# EAGLE design msp430_wbreakout (EAGLE 7.5.0)
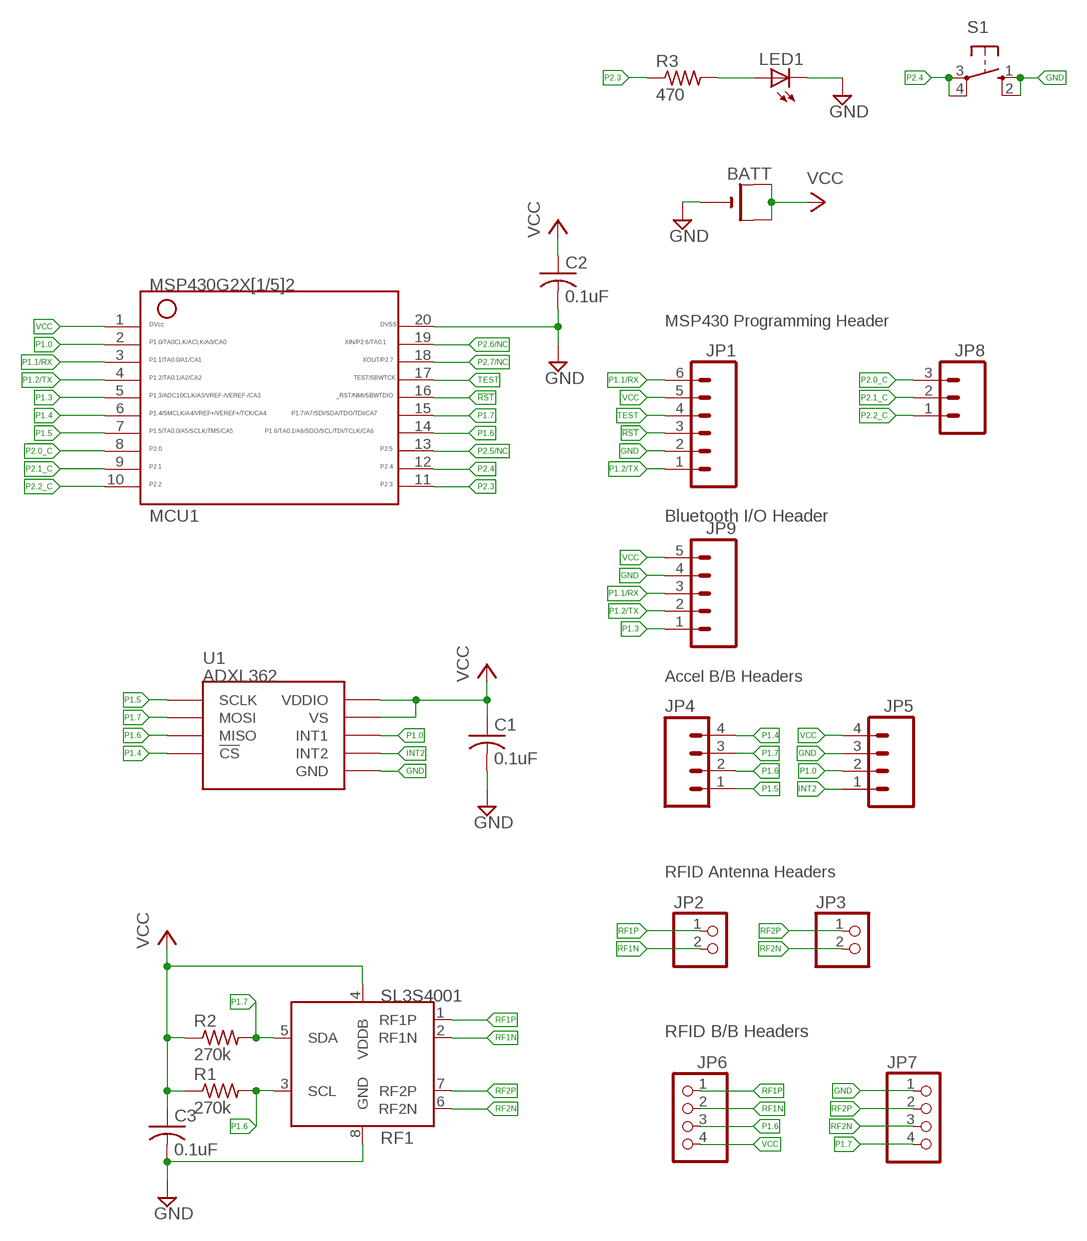
[diagram p0: schematic, sheet 1]

## Parts
BATT  CR2032SMT  [CR2032-SMD]
C1  0.1uF  C-USC0805  [C0805]
C2  0.1uF  C-USC0805K  [C0805K]
C3  0.1uF  C-USC0805  [C0805]
JP1  M06LOCK  [1X06_LOCK]
JP2  PINHD-1X2  [1X02]
JP3  PINHD-1X2  [1X02]
JP4  M04LOCK  [1X04_LOCK]
JP5  M04LOCK  [1X04_LOCK]
JP6  PINHD-1X4  [1X04]
JP7  PINHD-1X4  [1X04]
JP8  M03LOCK  [1X03_LOCK]
JP9  M05LOCK  [1X05_LOCK]
LED1  LEDCHIP-LED0805  [CHIP-LED0805]
MCU1  G2X[1/5]2---PW20  [PW20]
R1  270k  R-US_R0805  [R0805]
R2  270k  R-US_R0805  [R0805]
R3  470  R-US_R0805  [R0805]
RF1  SL3S4001  [SOT902-1/2/3]
S1  10-XX  [B3F-10XX]
U1  ADXL362  [ADXL362]

## Nets
!RST: JP1.3 MCU1.16
DVSS: C2.2 MCU1.20 ; supply symbol labelled GND
GND: BATT.- C1.2 C3.2 JP1.2 JP5.3 JP7.1 JP9.4 LED1.C RF1.8(GND) S1.1(S) S1.2(S1) U1.P$12(GND) U1.P$13(GND) U1.P$16(GND)
INT2: JP5.1 U1.P$9(INT2)
N$1: LED1.A R3.2
P1.0: JP5.2 MCU1.2 U1.P$11(INT1)
P1.1/RX: JP1.6 JP9.3 MCU1.3
P1.2/TX: JP1.1 JP9.2 MCU1.4
P1.3: JP9.1 MCU1.5
P1.4: JP4.4 MCU1.6 U1.P$8(!CS)
P1.5: JP4.1 MCU1.7 U1.P$4(SCLK)
P1.6: JP4.2 JP6.3 MCU1.14 R1.2 RF1.3(SCL) U1.P$7(MISO)
P1.7: JP4.3 JP7.4 MCU1.15 R2.2 RF1.5(SDA) U1.P$6(MOSI)
P2.0_C [cap_sensor]: JP8.3 MCU1.8
P2.1_C [cap_sensor]: JP8.2 MCU1.9
P2.2_C [cap_sensor]: JP8.1 MCU1.10
P2.3: MCU1.11 R3.1
P2.4: MCU1.12 S1.3(P) S1.4(P1)
P2.5/NC: MCU1.13
P2.6/NC: MCU1.19
P2.7/NC: MCU1.18
RF1N: JP2.2 JP6.2 RF1.2(RF1N)
RF1P: JP2.1 JP6.1 RF1.1(RF1P)
RF2N: JP3.2 JP7.3 RF1.6(RF2N)
RF2P: JP3.1 JP7.2 RF1.7(RF2P)
TEST: JP1.4 MCU1.17
VCC: BATT.+$1(+) BATT.+$2(+1) C1.1 C2.1 C3.1 JP1.5 JP5.4 JP6.4 JP9.5 MCU1.1 R1.1 R2.1 RF1.4(VDDB) U1.P$1(VDDIO) U1.P$14(VS)

## Notes on the sheet
- MSP430 Programming Header
- Bluetooth I/O Header
- Accel B/B Headers
- RFID Antenna Headers
- RFID B/B Headers

## Library data of the parts
BATT = adafruit:CR2032
C1-C3 = rcl:C-US: CAPACITOR, American symbol
JP1 = SparkFun-Connectors:M06: Header 6 Standard 6-pin 0.1" header. Use with straight break away headers (SKU : PRT-00116), right angle break away headers (PRT-00553), swiss pins (PRT-00743), machine pins (PRT-00117), and female headers (PRT-00115). Molex polarized connector foot print use with SKU : PRT-08094 with associated crimp pins and housings. NOTES ON THE VARIANTS LOCK and LOCK_LONGPADS... This footprint was designed to help hold the alignment of a through-hole component (i.e. 6-pin header) while soldering it into place. You may notice that each hole has been shifted either up or down by 0.005 of an inch from it's more standard position (which is a perfectly straight line). This slight alteration caused the pins (the squares in the middle) to touch the edges of the holes. Because they are alternating, it causes a "brace" to hold the component in place. 0.005 has proven to be the perfect amount of "off-center" position when using our standard breakaway headers. Although looks a little odd when you look at the bare footprint, once you have a header in there, the alteration is very hard to notice. Also,if you push a header all the way into place, it is covered up entirely on the bottom side. This idea of altering the position of holes to aid alignment will be further integrated into the Sparkfun Library for other footprints. It can help hold any component with 3 or more connection pins.
JP2 JP3 = pinhead:PINHD-1X2: PIN HEADER
JP4 JP5 = SparkFun-Connectors:M04: Header 4 Standard 4-pin 0.1" header. Use with straight break away headers (SKU : PRT-00116), right angle break away headers (PRT-00553), swiss pins (PRT-00743), machine pins (PRT-00117), and female headers (PRT-00115). Molex polarized connector foot print use with SKU : PRT-08231 with associated crimp pins and housings. 1MM SMD Version SKU: PRT-10208; PROD_ID: CONN-09696
JP6 JP7 = pinhead:PINHD-1X4: PIN HEADER
JP8 = SparkFun-Connectors:M03: Header 3 Standard 3-pin 0.1" header. Use with straight break away headers (SKU : PRT-00116), right angle break away headers (PRT-00553), swiss pins (PRT-00743), machine pins (PRT-00117), and female headers (PRT-00115). Molex polarized connector foot print use with SKU : PRT-08232 with associated crimp pins and housings.
JP9 = SparkFun-Connectors:M05: Header 5 Standard 5-pin 0.1" header. Use with straight break away headers (SKU : PRT-00116), right angle break away headers (PRT-00553), swiss pins (PRT-00743), machine pins (PRT-00117), and female headers (PRT-00115). Molex polarized connector foot print use with SKU : PRT-08230 with associated crimp pins and housings.
LED1 = led:LED: LED OSRAM: - CHIPLED LG R971, LG N971, LY N971, LG Q971, LY Q971, LO R971, LY R971 LH N974, LH R974 LS Q976, LO Q976, LY Q976 LO Q996 - Hyper CHIPLED LW Q18S LB Q993, LB Q99A, LB R99A - SideLED LS A670, LO A670, LY A670, LG A670, LP A670 LB A673, LV A673, LT A673, LW A673 LH A674 LY A675 LS A676, LA A676, LO A676, LY A676, LW A676 LS A679, LY A679, LG A679 - Hyper Micro SIDELED® LS Y876, LA Y876, LO Y876, LY Y876 LT Y87S - SmartLED LW L88C, LW L88S LB L89C, LB L89S, LG L890 LS L89K, LO L89K, LY L89K LS L896, LA L896, LO L896, LY L896 - TOPLED LS T670, LO T670, LY T670, LG T670, LP T670 LSG T670, LSP T670, LSY T670, LOP T670, LYG T670 LG T671, LOG T671, LSG T671 LB T673, LV T673, LT T673, LW T673 LH T674 LS T676, LA T676, LO T676, LY T676, LB T676, LH T676, LSB T676, LW T676 LB T67C, LV T67C, LT T67C, LS T67K, LO T67K, LY T67K, LW E67C LS E67B, LA E67B, LO E67B, LY E67B, LB E67C, LV E67C, LT E67C LW T67C LS T679, LY T679, LG T679 LS T770, LO T770, LY T770, LG T770, LP T770 LB T773, LV T773, LT T773, LW T773 LH T774 LS E675, LA E675, LY E675, LS T675 LS T776, LA T776, LO T776, LY T776, LB T776 LHGB T686 LT T68C, LB T68C - Hyper Mini TOPLED® LB M676 - Mini TOPLED Santana® LG M470 LS M47K, LO M47K, LY M47K Source: http://www.osram.convergy.de LUXEON: - LUMILED® LXK2-PW12-R00, LXK2-PW12-S00, LXK2-PW14-U00, LXK2-PW14-V00 LXK2-PM12-R00, LXK2-PM12-S00, LXK2-PM14-U00 LXK2-PE12-Q00, LXK2-PE12-R00, LXK2-PE12-S00, LXK2-PE14-T00, LXK2-PE14-U00 LXK2-PB12-K00, LXK2-PB12-L00, LXK2-PB12-M00, LXK2-PB14-N00, LXK2-PB14-P00, LXK2-PB14-Q00 LXK2-PR12-L00, LXK2-PR12-M00, LXK2-PR14-Q00, LXK2-PR14-R00 LXK2-PD12-Q00, LXK2-PD12-R00, LXK2-PD12-S00 LXK2-PH12-R00, LXK2-PH12-S00 LXK2-PL12-P00, LXK2-PL12-Q00, LXK2-PL12-R00 Source: www.luxeon.com KINGBRIGHT: KA-3528ASYC Source: www.kingbright.com
MCU1 = TI_MSP430_v16:G2X[1/5]2---PW20: MSP430G2X[1/5]2 MSP430G2x52, MSP430G2x12 TSSOP (PW) 20 Pin Package http://focus.ti.com/docs/prod/folders/print/msp430g2452.html
R1-R3 = rcl:R-US_: RESISTOR, American symbol
RF1 = NXP_60_26022015:SL3S4001: The UHF EPCglobal Generation 2 standard allows the commercialized provision of mass adoption of UHF RFID technology for passive smart tags and labels. Main fields of applications are supply chain management and logistics for worldwide use with special consideration of European, US and Chinese frequencies to ensure that operating distances of several meters can be realized. The UCODE I2C is a product out of the NXP Semiconductors UCODE product family. The entire UCODE product family offers anti-collision and collision arbitration functionality. This allows a reader to simultaneously operate multiple labels/tags within its antenna field. A UCODE I2C based label/ tag requires no external power supply for contactless operation. Its contactless interface generates the power supply via the antenna circuit by propagative energy transmission from the interrogator (reader), while the system clock is generated by an on-chip oscillator. Data transmitted from the interrogator to the label/tag is demodulated by the interface, and it also modulates the interrogator's electromagnetic field for data transmission from the label/tag to the interrogator. A label/tag can be operated without the need for line of sight or battery, as long as it is connected to a dedicated antenna for the targeted frequency range. When the label/tag is within the interrogator's operating range, the high-speed wireless interface allows data transmission in both directions. The UCODE I2C also features an I2C interface to read/write data from its build in memory. In this mode the UCODE I2C needs to be supplied externally. The I2C interface supports standard and fast I2C modes. The used EEPROM is based on a field proven non-volatile memory technology. The EEPROM memory cell is also used in high quality automotive applications. AAL Eindhoven MK
S1 = switch-omron:10-XX: OMRON SWITCH; MPN: B3F-1000; OC_FARNELL: 176432; OC_NEWARK: 36M3542
U1 = SparkFun-Sensors:ADXL362: Micropower 3-axis accelerometer 2/4/8g digital output (SPI) IC-11297; PROD_ID: IC-11297

## Net classes
0 default: width 0.254 mm
1 cap_sensor: width 0.254 mm

## Board
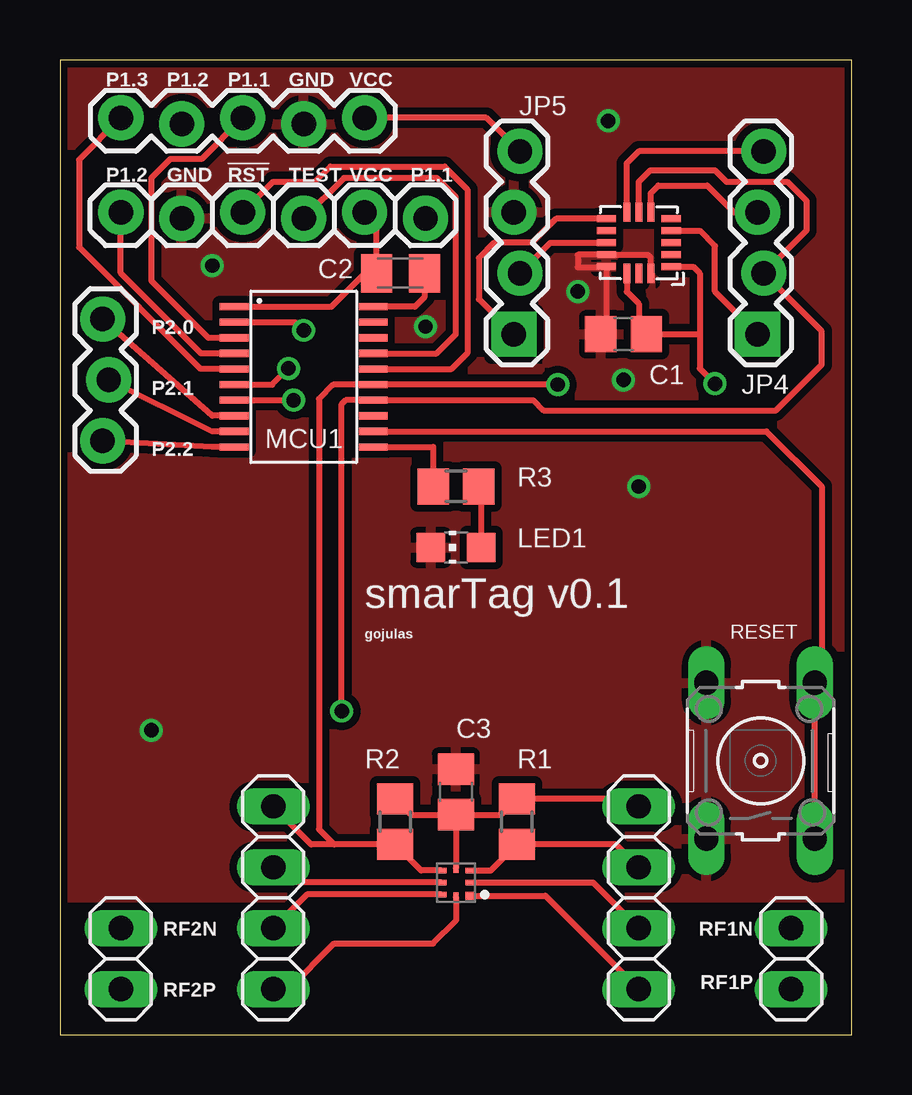
[diagram p1: board, top side]
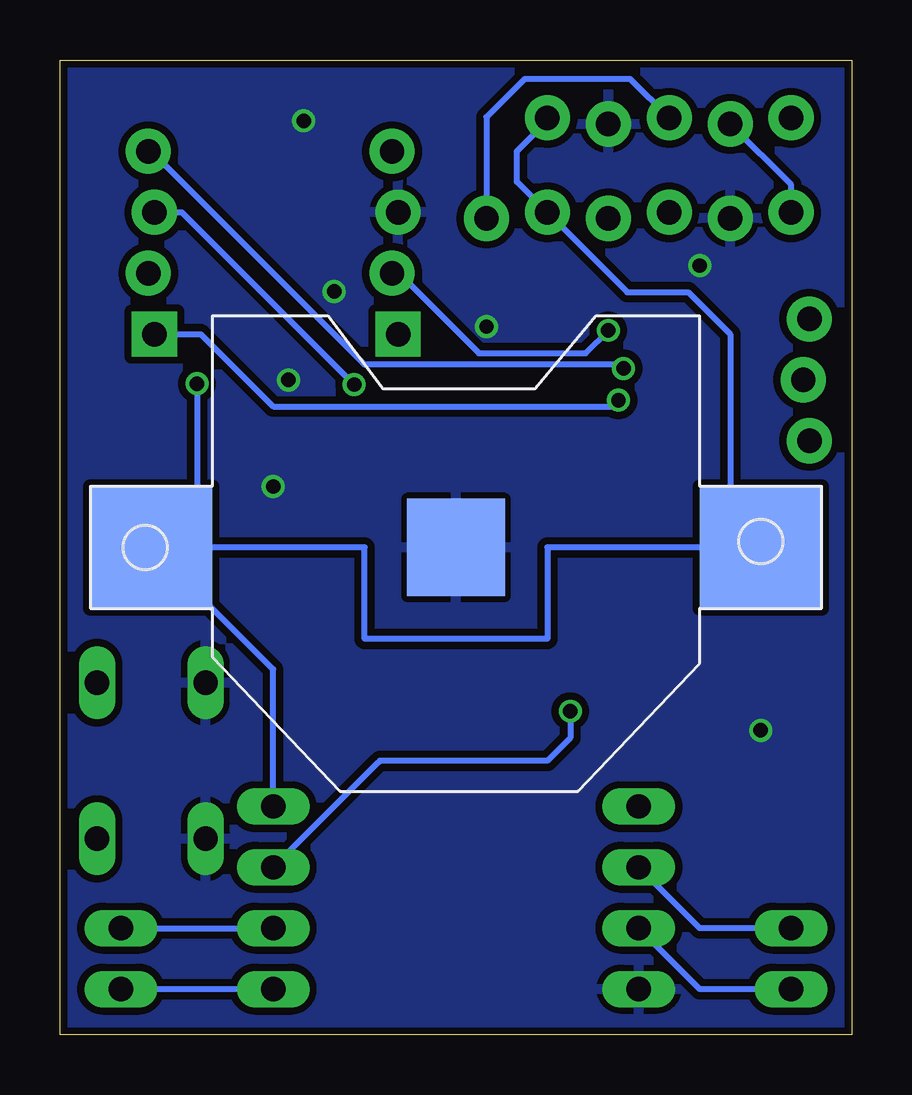
[diagram p2: board, bottom side, seen from below]

Size 33.02 x 40.64 mm. Coordinates in mm from the lower left corner, seen from the top.
Outline: 0,0 33.02,0 33.02,40.64 0,40.64 0,0
Copper layers (1*16): Top 0.035mm / dielectric 1.5mm / Bottom 0.035mm
Design rules "SparkFun-2-layer-TIGHT": minimum track width 7mil, minimum drill 15mil, track to track 7mil, track to pad 7mil, pad to pad 7mil, via to via 7mil, smd to smd 7mil, copper to edge 7mil, drill to drill 7mil, minimum pad ring 7mil, minimum via ring 7mil, stop-mask expansion 4mil, vias tented up to drill 20mil, thermal gap 10mil

### Footprints (pad centres in the part's own frame; a part is rotated, then mirrored left to right if it is on the bottom)
CR2032-SMD = smd 5.08 x 5.08: +$1 -12.7,0; +$2 12.7,0 | smd 4.064 x 4.064: - 0,0
C0805 = smd 1.3 x 1.5: 1 -0.95,0; 2 0.95,0
C0805K = smd 1.3 x 1.6: 1 -1,0; 2 1,0
1X06_LOCK = drill 1.016 pad 1.88: 1 0,0; 2 2.54,-0.254; 3 5.08,0; 4 7.62,-0.254; 5 10.16,0; 6 12.7,-0.254
1X02 = drill 1.016 long: 1 -1.27,0; 2 1.27,0
1X04_LOCK = drill 1.016 pad 1.88 square: 1 0,0.127 | drill 1.016 pad 1.88: 2 2.54,-0.127; 3 5.08,0.127; 4 7.62,-0.127
1X04 = drill 1.016 long: 1 -3.81,0; 2 -1.27,0; 3 1.27,0; 4 3.81,0
1X03_LOCK = drill 1.016 pad 1.88: 1 0,0.127; 2 2.54,-0.127; 3 5.08,0.127
1X05_LOCK = drill 1.016 pad 1.88: 1 0,0.127; 2 2.54,-0.127; 3 5.08,0.127; 4 7.62,-0.127; 5 10.16,0.127
CHIP-LED0805 = smd 1.2 x 1.2: A 0,-1.05; C 0,1.05
PW20 = smd 0.3 x 1.2: 1 -2.925,-2.9; 2 -2.275,-2.9; 3 -1.625,-2.9; 4 -0.975,-2.9; 5 -0.325,-2.9; 6 0.325,-2.9; 7 0.975,-2.9; 8 1.625,-2.9; 9 2.275,-2.9; 10 2.925,-2.9; 11 2.925,2.9; 12 2.275,2.9; 13 1.625,2.9; 14 0.975,2.9; 15 0.325,2.9; 16 -0.325,2.9; 17 -0.975,2.9; 18 -1.625,2.9; 19 -2.275,2.9; 20 -2.925,2.9
R0805 = smd 1.3 x 1.5: 1 -0.95,0; 2 0.95,0
SOT902-1/2/3 = smd 0.4 x 0.32: 1 0.6,-0.55 | smd 0.4 x 0.22: 2 0.6,0; 3 0.6,0.5; 5 -0.6,0.5; 6 -0.6,0; 7 -0.6,-0.5 | smd 0.22 x 0.4: 4 0,0.6; 8 0,-0.6
B3F-10XX = drill 1.016 long: 1 -3.251,2.261; 2 3.251,2.261; 3 -3.251,-2.261; 4 3.251,-2.261
ADXL362 = smd 0.8 x 0.3: P$1 -1.35,1; P$2 -1.35,0.5; P$3 -1.35,0; P$4 -1.35,-0.5; P$5 -1.35,-1; P$9 1.35,-1; P$10 1.35,-0.5; P$11 1.35,0; P$12 1.35,0.5; P$13 1.35,1 | smd 0.3 x 0.8: P$6 -0.5,-1.275; P$7 0,-1.275; P$8 0.5,-1.275; P$14 0.5,1.275; P$15 0,1.275; P$16 -0.5,1.275

### Placement (x,y rotation side)
BATT  16.51,20.32 0 bottom
C1  23.5,29.21 180 top
C2  14.19,31.75 0 top
C3  16.51,10.13 90 top
JP1  2.54,34.29 0 top
JP2  30.48,3.17 90 top
JP3  2.54,3.17 90 top
JP4  29.21,29.21 90 top
JP5  19.05,29.21 90 top
JP6  24.13,5.71 90 top
JP7  8.89,5.71 90 top
JP8  1.91,24.77 90 top
JP9  2.54,38.1 0 top
LED1  16.51,20.32 90 top
MCU1  10.16,27.43 270 top
R1  19.05,8.89 270 top
R2  13.97,8.89 270 top
R3  16.51,22.86 0 top
RF1  16.51,6.35 0 top
S1  29.21,11.43 90 top
U1  24.13,33.02 180 top

### Tracks (layer width: path | path; a pad name or v marks a point on that pad's centre or on a via)
!RST
  Top 0.254: MCU1.16 16.33,27.76 16.99,28.42 16.99,35.24 16.03,36.2 11.27,36.2 10.64,35.56 8.89,35.56 JP1.3
DVSS
  Top 0.254: C2.2 15.19,30.75 14.8,30.36 MCU1.20
GND  (via drill 0.6)
  Top 0.254: C1.2 22.78,29.45 U1.P$13 22.78,32 21.59,32 21.59,32.52 U1.P$12 24.51,32.51 24.63,32.39 U1.P$16 | RF1.8 16.51,4.76 15.56,3.81 11.43,3.81 9.53,1.91 JP7.1
  Bottom 0.254: BATT.- 17.78,21.59
  other vias: 24.13,22.86 21.59,30.99 3.81,12.7 22.86,38.1 23.5,27.3 15.24,29.53 6.35,32.07
  pour Top (isolate 0.305): -2.54,45.72 34.29,45.72 34.29,5.71 -2.54,5.71
  pour Bottom (isolate 0.305): -3.81,46.99 -3.81,-1.27 36.83,-1.27 36.83,46.99
INT2
  Top 0.254: U1.P$9 20.68,34.02 19.68,33.02 18.1,33.02 17.46,32.38 17.46,30.67 JP5.1
N$1
  Top 0.254: R3.2 17.56,22.86 LED1.A
P1.0  (via drill 0.6)
  Top 0.254: U1.P$11 20.45,33.02 JP5.2 | MCU1.2 9.82,29.71 v10.16,29.37
  Bottom 0.254: v10.16,29.37 11.11,28.42 15.56,28.42 18.89,31.75 JP5.2
P1.1/RX
  Top 0.254: JP9.3 5.91,36.51 4.6,36.51 3.81,35.72 3.81,31.43 6.19,29.06 MCU1.3
  Bottom 0.254: JP9.3 9.24,39.85 13.65,39.85 15.24,38.26 JP1.6
P1.2/TX
  Top 0.254: MCU1.4 5.88,28.41 2.54,31.75 JP1.1
  Bottom 0.254: JP1.1 2.54,35.43 JP9.2
P1.3
  Top 0.254: MCU1.5 5.87,27.76 0.79,32.84 0.79,36.48 JP9.1
P1.4  (via drill 0.6)
  Top 0.254: U1.P$8 23.63,36.33 24.13,36.83 JP4.4 | MCU1.6 8.85,27.11 v9.53,27.78
  Bottom 0.254: v9.53,27.78 9.68,27.94 20.32,27.94 29.21,36.83 JP4.4
P1.5  (via drill 0.6)
  Top 0.254: U1.P$4 26.67,33.52 27.3,32.88 27.3,30.99 JP4.1 | MCU1.7 v9.74,26.46
  Bottom 0.254: JP4.1 27.15,29.21 24.13,26.19 10,26.19 v9.74,26.46
P1.6  (via drill 0.6)
  Top 0.254: U1.P$7 24.13,35.56 24.61,36.04 27.3,36.04 27.78,35.56 30.32,35.56 31.11,34.77 31.11,33.53 JP4.2 31.75,29.34 31.75,27.94 29.84,26.04 20.16,26.04 19.74,26.46 MCU1.14 11.91,26.46 11.75,26.3 v11.75,13.49 | JP6.3 23.18,7.94 R1.2 17.96,6.85 RF1.3
  Bottom 0.254: JP6.3 20.64,10.48 19.84,11.27 19.68,11.43 12.7,11.43 11.75,12.38 v11.75,13.49
P1.7  (via drill 0.6)
  Top 0.254: U1.P$6 24.63,35.08 24.95,35.4 26.99,35.4 28.1,34.29 JP4.3 | v20.76,27.11 MCU1.15 11.39,27.11 10.79,26.51 10.79,8.57 11.43,7.94 | 11.43,7.94 R2.2 15.06,6.85 RF1.5 | 11.43,7.94 10.47,7.94 JP7.4
  Bottom 0.254: JP4.3 27.94,34.29 v20.76,27.11
P2.0_C
  Top 0.254: MCU1.8 6.35,25.81 JP8.3
P2.1_C
  Top 0.254: MCU1.9 6.35,25.16 JP8.2
P2.2_C
  Top 0.254: MCU1.10 6.35,24.51 JP8.1
P2.3
  Top 0.254: MCU1.11 15.56,24.51 R3.1
P2.4
  Top 0.254: MCU1.12 29.45,25.16 31.75,22.86 31.75,14.96 S1.4 S1.3
RF1N
  Top 0.254: RF1.2 22.23,6.35 JP6.2
  Bottom 0.254: JP2.2 JP6.2
RF1P
  Top 0.254: RF1.1 20.23,5.8 JP6.1
  Bottom 0.254: JP6.1 JP2.1
RF2N
  Top 0.254: RF1.6 9.53,6.35 JP7.3
  Bottom 0.254: JP3.2 6.35,4.45 JP7.3
RF2P
  Top 0.254: RF1.7 10.29,5.85 JP7.2
  Bottom 0.254: JP3.1 6.35,1.91 JP7.2
TEST
  Top 0.254: JP1.4 11.84,35.72 15.72,35.72 16.51,34.92 16.51,29.21 15.71,28.41 MCU1.17
VCC  (via drill 0.6)
  Top 0.254: U1.P$14 23.63,30.98 24.13,30.48 24.13,29.52 C1.1 26.67,29.21 | C3.1 RF1.4 | MCU1.1 11.32,30.36 12.72,31.75 C2.1 13.19,33.8 JP1.5 | JP5.4 17.78,38.23 JP9.5 | JP6.4 24.13,9.84 R1.1 18.39,9.18 C3.1 | U1.P$1 26.4,32.02 26.67,31.75 26.67,29.21 | 26.67,29.21 26.67,27.78 v27.3,27.15 | R2.1 14.63,9.18 C3.1
  Bottom 0.254: JP6.4 24.13,15.24 BATT.+$1 | JP9.5 12.7,38.1 13.97,36.83 13.97,35.56 JP1.5 9.37,30.96 6.83,30.96 5.08,29.21 5.08,21.59 BATT.+$2 12.7,20.32 12.7,16.51 20.32,16.51 20.32,20.32 BATT.+$1 | v27.3,27.15 27.3,22.23 BATT.+$1

### Text on the board
tPlace: P1.3 | P1.2 | P1.1 | GND | VCC | P1.2 | GND | !RST | TEST | VCC | P1.1 | P2.0 | P2.1 | P2.2 | smarTag v0.1 | gojulas | RESET | RF2N | RF1N | RF2P | RF1P